# EAGLE schematic main_schematic_2 (EAGLE 8.6.0)
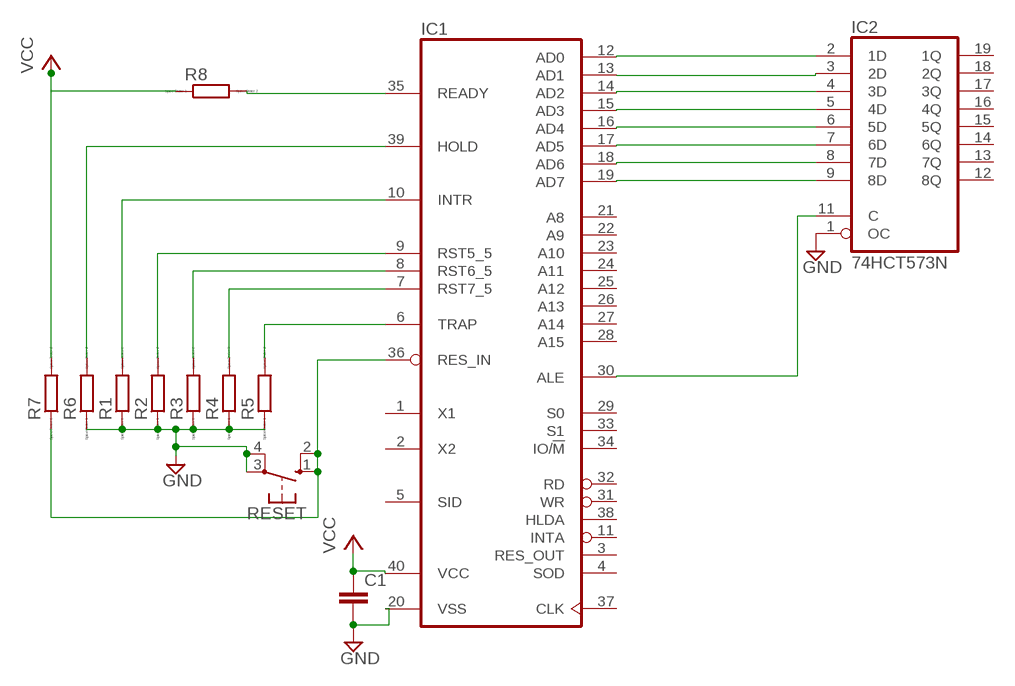
[diagram p0: schematic, sheet 1]

## Parts
C1  C2,5-3  [C2.5-3]
IC1  8085  [DIL40]
IC2  74HCT573N  [DIL20]
R1  R0204/7  [0204/7]
R2  R0204/7  [0204/7]
R3  R0204/7  [0204/7]
R4  R0204/7  [0204/7]
R5  R0204/7  [0204/7]
R6  R0204/7  [0204/7]
R7  R0204/7  [0204/7]
R8  R0204/7  [0204/7]
RESET  10-XX  [B3F-10XX]

## Nets
GND: C1.2 IC1.20(VSS) R1.1 R2.1 R3.1 R4.1 R5.1 R6.1 RESET.3(P) RESET.4(P1)
N$1: IC1.39(HOLD) R6.2
N$2: IC1.10(INTR) R1.2
N$3: IC1.9(RST5_5) R2.2
N$4: IC1.8(RST6_5) R3.2
N$5: IC1.7(RST7_5) R4.2
N$6: IC1.6(TRAP) R5.2
N$7: IC1.36(RES_IN) R7.1 RESET.1(S) RESET.2(S1)
N$8: IC1.35(READY) R8.2
N$9: IC1.30(ALE) IC2.11(C)
N$10: IC1.12(AD0) IC2.2(1D)
N$11: IC1.13(AD1) IC2.3(2D)
N$12: IC1.14(AD2) IC2.4(3D)
N$13: IC1.15(AD3) IC2.5(4D)
N$14: IC1.16(AD4) IC2.6(5D)
N$15: IC1.17(AD5) IC2.7(6D)
N$16: IC1.18(AD6) IC2.8(7D)
N$17: IC1.19(AD7) IC2.9(8D)
VCC: C1.1 IC1.40(VCC) R7.2 R8.1
Unconnected: IC1.1(X1) IC1.2(X2) IC1.3(RES_OUT) IC1.4(SOD) IC1.5(SID) IC1.11(INTA) IC1.21(A8) IC1.22(A9) IC1.23(A10) IC1.24(A11) IC1.25(A12) IC1.26(A13) IC1.27(A14) IC1.28(A15) IC1.29(S0) IC1.31(WR) IC1.32(RD) IC1.33(S1) IC1.34(IO/!M) IC1.37(CLK) IC1.38(HLDA) IC2.1(OC) IC2.12(8Q) IC2.13(7Q) IC2.14(6Q) IC2.15(5Q) IC2.16(4Q) IC2.17(3Q) IC2.18(2Q) IC2.19(1Q)

## Power pins joined to a net without a drawn wire
GND: IC2.10(GND)
VCC: IC2.20(VCC)

## Library data of the parts
C1 = capacitor-wima:C: CAPACITOR naming: grid - package width
IC1 = micro-intel:8085: MICROCOMPUTER/PERIPHERAL DEVICE; OC_FARNELL: unknown; OC_NEWARK: unknown
IC2 = 74xx-eu:74*573: 8-bit D latch BUS DRIVER
R1-R8 = eagle-ltspice:R: RESISTOR, European symbol; SPICEMODEL: NONE; SPICEPREFIX: R
RESET = CEDT:10-XX: OMRON SWITCH